# EAGLE design dimmer (EAGLE 6.2)
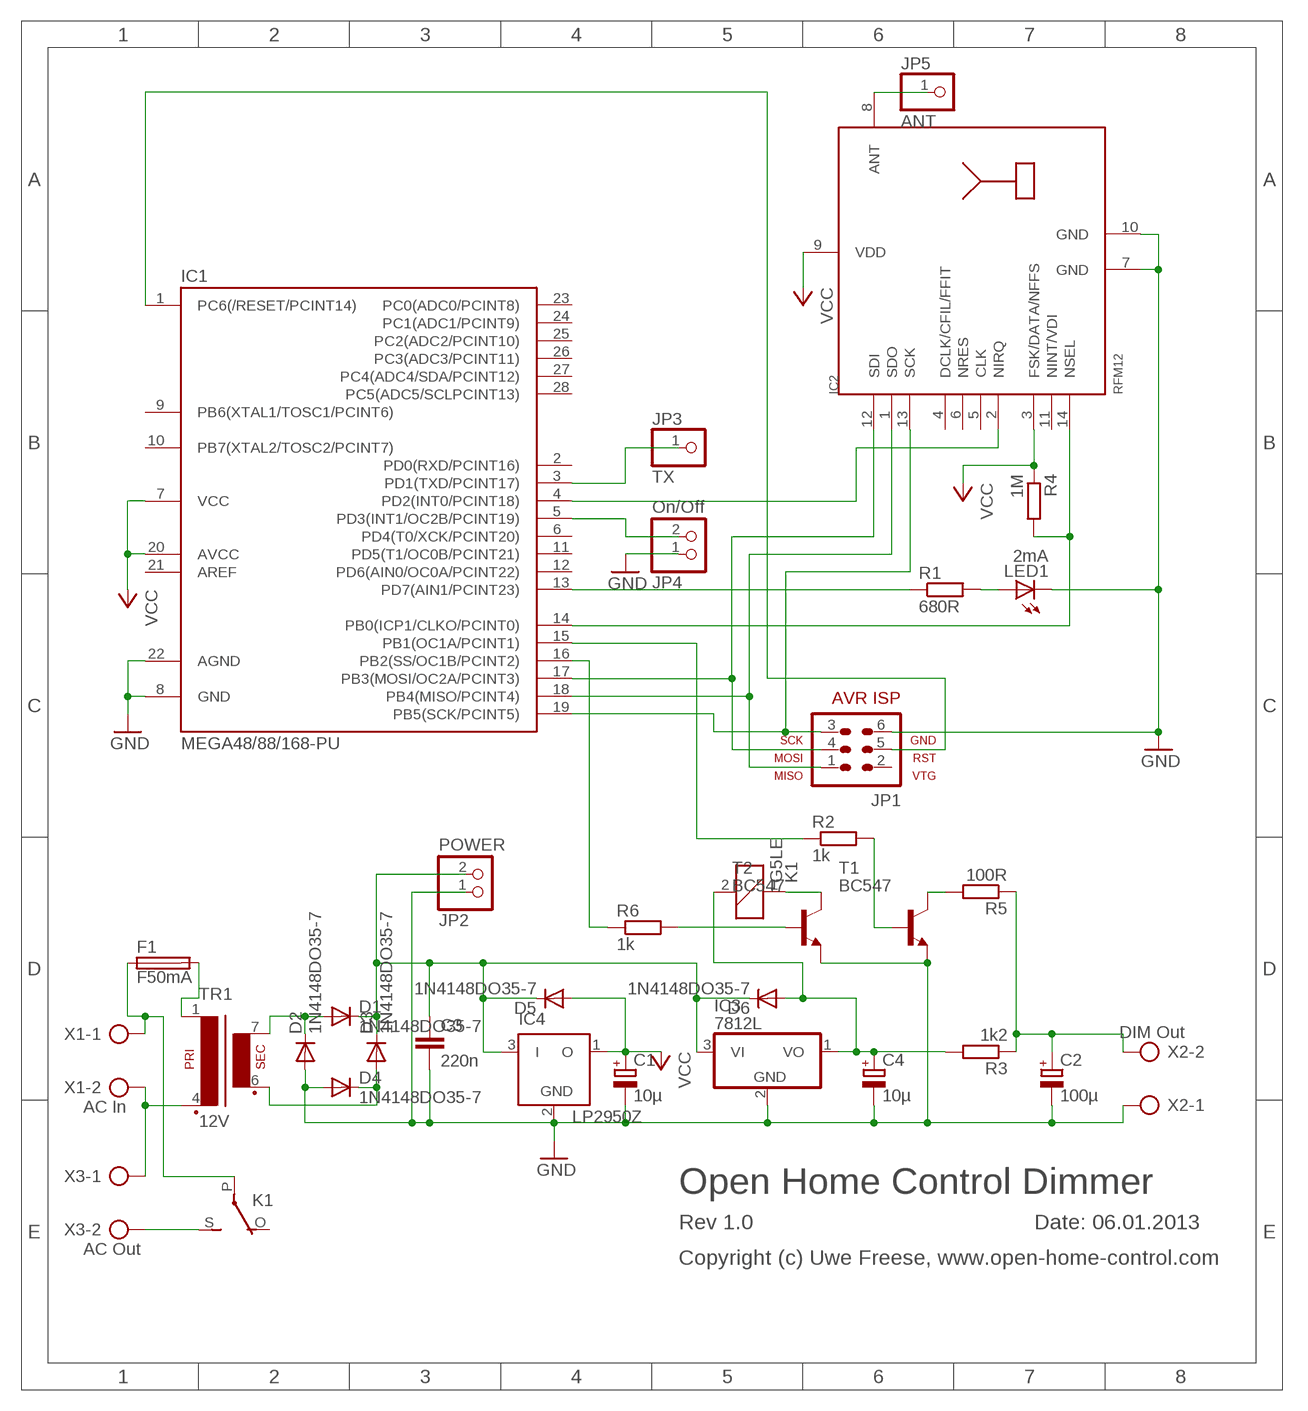
[diagram p0: schematic, sheet 1]

## Parts
C1  10µ  CPOL-EUE1.8-4  [E1,8-4]
C2  100µ  CPOL-EUE1.8-4  [E1,8-4]
C3  220n  C-EU025-030X050  [C025-030X050]
C4  10µ  CPOL-EUE1.8-4  [E1,8-4]
D1  1N4148DO35-7  [DO35-7]
D2  1N4148DO35-7  [DO35-7]
D3  1N4148DO35-7  [DO35-7]
D4  1N4148DO35-7  [DO35-7]
D5  1N4148DO35-7  [DO35-7]
D6  1N4148DO35-7  [DO35-7]
F1  F50mA  GSH15  [GSH15]
IC1  MEGA48/88/168-PU  [DIL28-3]
IC2  RFM12  [RFM]
IC3  7812L  [TO92]
IC4  LP2950Z  [TO92]
JP1  AVR-ISP-6  [AVR-ISP-6]
JP2  POWER  PINHD-1X2  [1X02]
JP3  TX  PINHD-1X1  [1X01]
JP4  On/Off  PINHD-1X2  [1X02]
JP5  ANT  PINHD-1X1  [1X01]
K1  G5LE  [G5LE]
LED1  2mA  LED3MM  [LED3MM]
R1  680R  R-EU_0207/7  [0207/7]
R2  1k  R-EU_0207/7  [0207/7]
R3  1k2  R-EU_0207/7  [0207/7]
R4  1M  R-EU_0207/7  [0207/7]
R5  100R  R-EU_0207/7  [0207/7]
R6  1k  R-EU_0207/7  [0207/7]
T1  BC547  [TO92]
T2  BC547  [TO92]
TR1  12V  EE20-1  [EE20-1]
X1  AC In  AK500/2  [AK500/2]
X2  DIM Out  AK500/2  [AK500/2]
X3  AC Out  AK500/2  [AK500/2]

## Nets
GND: C1.- C2.- C3.2 C4.- D2.A D4.A IC1.8(GND) IC1.22(AGND) IC2.7(GND) IC2.10(GND) IC3.2(GND) IC4.2(GND) JP1.6 JP2.1 JP4.1 LED1.K(C) T1.1(E) T2.1(E) X2.1
N$1: D1.A D2.C TR1.7(S4)
N$2: R5.2 T1.3(C)
N$3: IC1.17(PB3(MOSI/OC2A/PCINT3)) IC2.12(SDI) JP1.4
N$4: IC1.18(PB4(MISO/PCINT4)) IC2.1(SDO) JP1.1
N$5: IC1.19(PB5(SCK/PCINT5)) IC2.13(SCK) JP1.3
N$6: IC1.13(PD7(AIN1/PCINT23)) R1.1
N$7: D3.A D4.C TR1.6(S3)
N$8: IC1.1(PC6(/RESET/PCINT14)) JP1.5
N$9: C3.1 D1.C D3.C D5.C D6.C IC3.3(VI) IC4.3(I) JP2.2
N$10: C4.+ D6.A IC3.1(VO) K1.2 R3.2
N$11: IC2.8(ANT) JP5.1
N$12: LED1.A R1.2
N$13: IC1.14(PB0(ICP1/CLKO/PCINT0)) IC2.14(NSEL) R4.2
N$14: IC1.15(PB1(OC1A/PCINT1)) R2.1
N$15: IC1.4(PD2(INT0/PCINT18)) IC2.2(NIRQ)
N$16: R2.2 T1.2(B)
N$17: C2.+ R3.1 R5.1 X2.2
N$18: K1.1 T2.3(C)
N$19: TR1.4(P2) X1.2 X3.1
N$21: K1.S(2:S) X3.2
N$22: F1.1 K1.P(2:P) X1.1
N$23: F1.2 TR1.1
N$24: R6.2 T2.2(B)
N$25: IC1.16(PB2(SS/OC1B/PCINT2)) R6.1
N$26: IC1.3(PD1(TXD/PCINT17)) JP3.1
N$27: IC1.5(PD3(INT1/OC2B/PCINT19)) JP4.2
VCC: C1.+ D5.A IC1.7(VCC) IC1.20(AVCC) IC2.3(FSK/DATA/NFFS) IC2.9(VDD) IC4.1(O) R4.1
Unconnected: IC1.2(PD0(RXD/PCINT16)) IC1.6(PD4(T0/XCK/PCINT20)) IC1.9(PB6(XTAL1/TOSC1/PCINT6)) IC1.10(PB7(XTAL2/TOSC2/PCINT7)) IC1.11(PD5(T1/OC0B/PCINT21)) IC1.12(PD6(AIN0/OC0A/PCINT22)) IC1.21(AREF) IC1.23(PC0(ADC0/PCINT8)) IC1.24(PC1(ADC1/PCINT9)) IC1.25(PC2(ADC2/PCINT10)) IC1.26(PC3(ADC3/PCINT11)) IC1.27(PC4(ADC4/SDA/PCINT12)) IC1.28(PC5(ADC5/SCLPCINT13)) IC2.4(DCLK/CFIL/FFIT) IC2.5(CLK) IC2.6(NRES) IC2.11(NINT/VDI) JP1.2 K1.O(2:O)

## Notes on the sheet
- Open Home Control Dimmer
- Rev 1.0 | Date: 06.01.2013
- Copyright (c) Uwe Freese, www.open-home-control.com

## Library data of the parts
C1 C2 C4 = rcl:CPOL-EU: POLARIZED CAPACITOR, European symbol
C3 = rcl:C-EU: CAPACITOR, European symbol
D1-D6 = diode:1N4148: DIODE high speed (Philips)
F1 = fuse:GSH15: FUSE HOLDER grid 15mm, 19649 Wickmann; MPN: 64900001039; OC_FARNELL: 1271673; OC_NEWARK: 02P0318
IC1 = avr-5-4.16:MEGA48/88/168-PU
IC2 = hopeRF:RFM12
IC3 = linear:78*: Positive VOLTAGE REGULATOR Source: http://cache.national.com/ds/LM/LM78L05.pdf http://www.fairchildsemi.com/ds/LM/LM7805.pdf
IC4 = linear:LP2950: 100 mA, Low Power Low Dropout Voltage Regulator Source: http://www.onsemi.com/pub/Collateral/LP2950-D.PDF
JP1 = avr-5-4.16:AVR-ISP-6: AVR ISP-6 Serial Programming Header
JP2 JP4 = pinhead:PINHD-1X2: PIN HEADER
JP3 JP5 = pinhead:PINHD-1X1: PIN HEADER
K1 = relay:G5LE: RELAY 1 x switch, 10 A/120 V AC, 8 A/30 V DC, Omron; OC_FARNELL: unknown; OC_NEWARK: unknown
LED1 = led:LED: LED OSRAM: - CHIPLED LG R971, LG N971, LY N971, LG Q971, LY Q971, LO R971, LY R971 LH N974, LH R974 LS Q976, LO Q976, LY Q976 LO Q996 - Hyper CHIPLED LW Q18S LB Q993, LB Q99A, LB R99A - SideLED LS A670, LO A670, LY A670, LG A670, LP A670 LB A673, LV A673, LT A673, LW A673 LH A674 LY A675 LS A676, LA A676, LO A676, LY A676, LW A676 LS A679, LY A679, LG A679 - Hyper Micro SIDELED® LS Y876, LA Y876, LO Y876, LY Y876 LT Y87S - SmartLED LW L88C, LW L88S LB L89C, LB L89S, LG L890 LS L89K, LO L89K, LY L89K LS L896, LA L896, LO L896, LY L896 - TOPLED LS T670, LO T670, LY T670, LG T670, LP T670 LSG T670, LSP T670, LSY T670, LOP T670, LYG T670 LG T671, LOG T671, LSG T671 LB T673, LV T673, LT T673, LW T673 LH T674 LS T676, LA T676, LO T676, LY T676, LB T676, LH T676, LSB T676, LW T676 LB T67C, LV T67C, LT T67C, LS T67K, LO T67K, LY T67K, LW E67C LS E67B, LA E67B, LO E67B, LY E67B, LB E67C, LV E67C, LT E67C LW T67C LS T679, LY T679, LG T679 LS T770, LO T770, LY T770, LG T770, LP T770 LB T773, LV T773, LT T773, LW T773 LH T774 LS E675, LA E675, LY E675, LS T675 LS T776, LA T776, LO T776, LY T776, LB T776 LHGB T686 LT T68C, LB T68C - Hyper Mini TOPLED® LB M676 - Mini TOPLED Santana® LG M470 LS M47K, LO M47K, LY M47K Source: http://www.osram.convergy.de LUXEON: - LUMILED® LXK2-PW12-R00, LXK2-PW12-S00, LXK2-PW14-U00, LXK2-PW14-V00 LXK2-PM12-R00, LXK2-PM12-S00, LXK2-PM14-U00 LXK2-PE12-Q00, LXK2-PE12-R00, LXK2-PE12-S00, LXK2-PE14-T00, LXK2-PE14-U00 LXK2-PB12-K00, LXK2-PB12-L00, LXK2-PB12-M00, LXK2-PB14-N00, LXK2-PB14-P00, LXK2-PB14-Q00 LXK2-PR12-L00, LXK2-PR12-M00, LXK2-PR14-Q00, LXK2-PR14-R00 LXK2-PD12-Q00, LXK2-PD12-R00, LXK2-PD12-S00 LXK2-PH12-R00, LXK2-PH12-S00 LXK2-PL12-P00, LXK2-PL12-Q00, LXK2-PL12-R00 Source: www.luxeon.com KINGBRIGHT: KA-3528ASYC Source: www.kingbright.com
R1-R6 = rcl:R-EU_: RESISTOR, European symbol
T1 T2 = transistor:BC547: NPN TRANSISTOR
TR1 = trafo:EE20-1: TRANSFORMER 1 primary winding, 1 secondary winding ERA
X1-X3 = con-ptr500:AK500/2: CONNECTOR; OC_FARNELL: unknown; OC_NEWARK: unknown

## Board
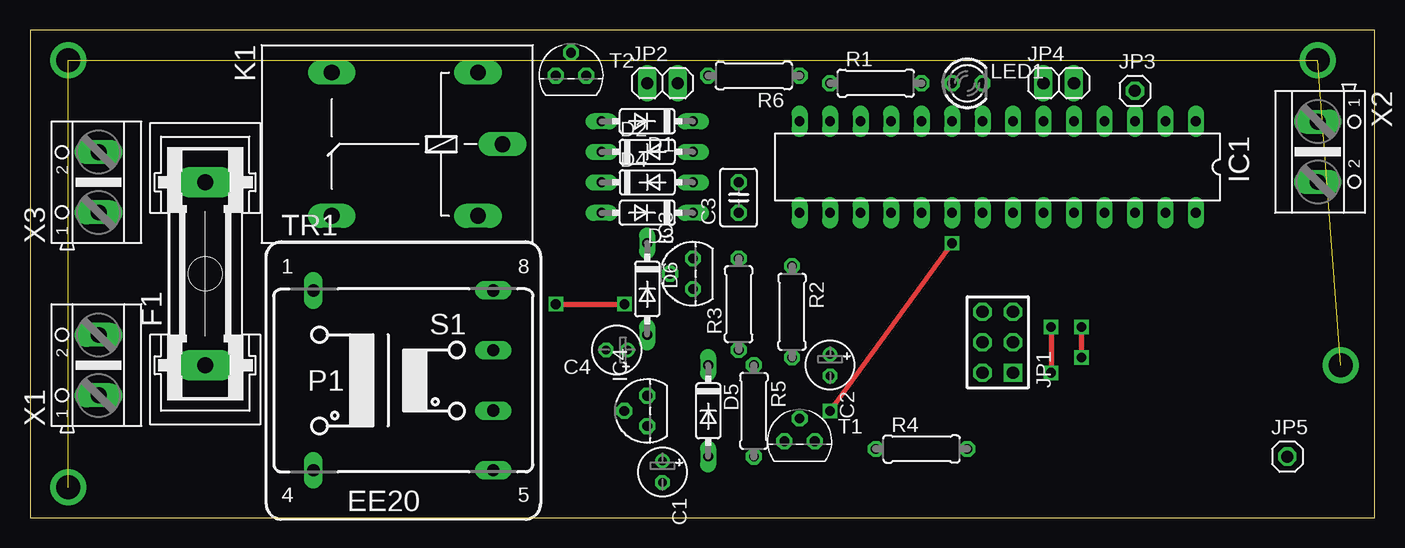
[diagram p1: board, top side]
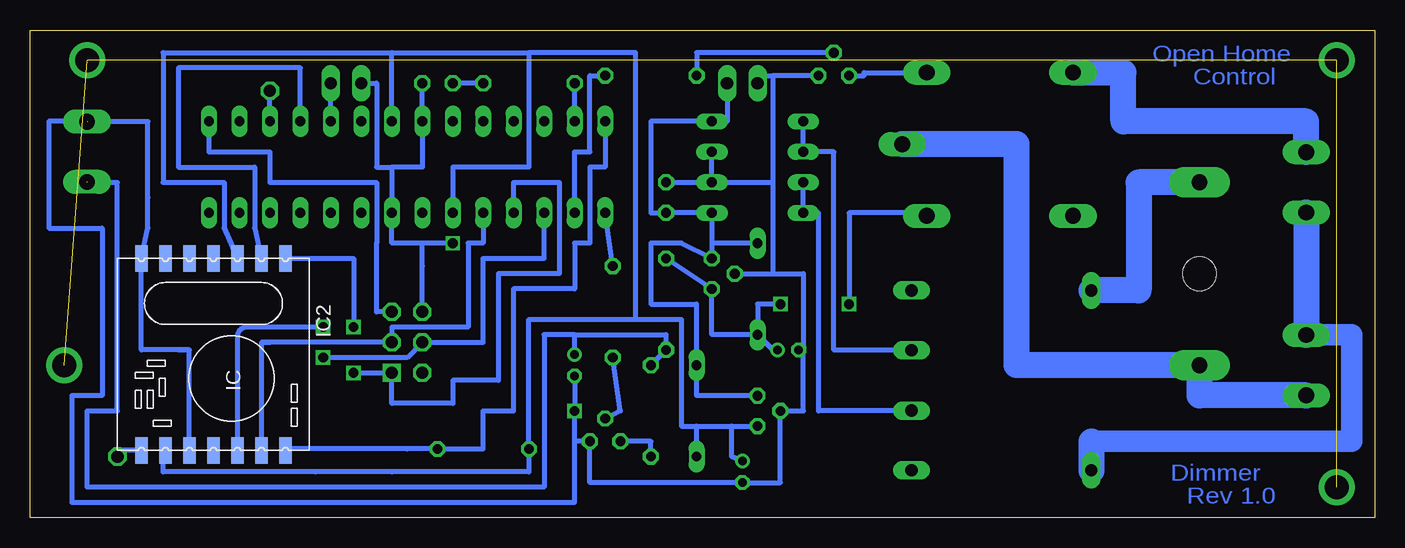
[diagram p2: board, bottom side, seen from below]

Size 112.06 x 40.63 mm. Coordinates in mm from the lower left corner, seen from the top.
Outline: 0,0 112.06,0 112.06,40.63 0,40.63 0,0
Copper layers (1*16): Top 0.035mm / dielectric 1.5mm / Bottom 0.035mm
Design rules: minimum track width 10mil, minimum drill 24mil, track to track 8mil, track to pad 8mil, pad to pad 8mil, via to via 8mil, smd to smd 8mil, copper to edge 40mil, drill to drill 8mil, minimum pad ring 10mil, minimum via ring 8mil, stop-mask expansion 4mil, vias tented up to drill 0mil, thermal gap 10mil

### Footprints (pad centres in the part's own frame; a part is rotated, then mirrored left to right if it is on the bottom)
E1,8-4 = drill 0.711 pad 1.168: + -0.889,0 | drill 0.711 pad 1.168 octagon: - 0.889,0
C025-030X050 = drill 0.813 octagon: 1 -1.27,0; 2 1.27,0
DO35-7 = drill 0.813 long: A 3.81,0; C -3.81,0
GSH15 = drill 1.321 pad 2.54 long: 1 -7.62,0; 2 7.62,0 | hole 2.794: 0,0
DIL28-3 = drill 0.813 long: 1 -16.51,-3.81; 2 -13.97,-3.81; 3 -11.43,-3.81; 4 -8.89,-3.81; 5 -6.35,-3.81; 6 -3.81,-3.81; 7 -1.27,-3.81; 8 1.27,-3.81; 9 3.81,-3.81; 10 6.35,-3.81; 11 8.89,-3.81; 12 11.43,-3.81; 13 13.97,-3.81; 14 16.51,-3.81; 15 16.51,3.81; 16 13.97,3.81; 17 11.43,3.81; 18 8.89,3.81; 19 6.35,3.81; 20 3.81,3.81; 21 1.27,3.81; 22 -1.27,3.81; 23 -3.81,3.81; 24 -6.35,3.81; 25 -8.89,3.81; 26 -11.43,3.81; 27 -13.97,3.81; 28 -16.51,3.81
RFM = smd 2.184 x 1.067: 1 0,14; 2 0,12; 3 0,10; 4 0,8; 5 0,6; 6 0,4; 7 0,2; 8 16,2; 9 16,4; 10 16,6; 11 16,8; 12 16,10; 13 16,12; 14 16,14
TO92 = drill 0.813 octagon: 1 -1.27,0; 2 0,1.905; 3 1.27,0
AVR-ISP-6 = drill 1.016 square: 1 -2.54,-1.27 | drill 1.016 octagon: 2 -2.54,1.27; 3 0,-1.27; 4 0,1.27; 5 2.54,-1.27; 6 2.54,1.27
1X02 = drill 1.016 long: 1 -1.27,0; 2 1.27,0
1X01 = drill 1.016 octagon: 1 0,0
G5LE = drill 1.321 long: 1 -7.493,-5.969; 2 -7.493,5.969; O 4.699,5.969; P -9.525,0; S 4.699,-5.969
LED3MM = drill 0.813 octagon: A -1.27,0; K 1.27,0
0207/7 = drill 0.813 octagon: 1 -3.81,0; 2 3.81,0
TO92' = drill 0.813 octagon: 1 1.27,0; 2 0,1.905; 3 -1.27,0
EE20-1 = drill 1.016 long: 1 -7.493,7.493; 4 -7.493,-7.493; 5 7.493,-7.493; 6 7.493,-2.515; 7 7.493,2.515; 8 7.493,7.493
AK500/2 = drill 1.321 long: 1 -2.515,0; 2 2.515,0

### Placement (x,y rotation side)
C1  52.7,3.81 270 top
C2  66.67,12.7 270 top
C3  59.06,26.67 90 top
C4  48.89,13.97 180 top
D1  51.44,33.02 180 top
D2  51.44,30.48 0 top
D3  51.44,25.4 180 top
D4  51.44,27.94 0 top
D5  56.52,8.89 270 top
D6  51.44,19.05 270 top
F1  14.61,20.32 90 top
IC1  80.65,29.21 180 top
IC2  104.78,21.59 270 bottom
IC3  55.25,20.32 90 top
IC4  51.44,8.89 90 top
JP1  80.65,14.61 90 top
JP2  52.7,36.2 0 top
JP3  92.08,35.56 0 top
JP4  85.73,36.2 0 top
JP5  104.78,5.08 0 top
K1  29.84,31.11 180 top
LED1  78.11,36.2 0 top
R1  70.48,36.2 0 top
R2  63.5,17.14 270 top
R3  59.06,17.78 90 top
R4  74.3,5.71 0 top
R5  60.33,8.89 270 top
R6  60.33,36.83 180 top
T1  BC547  [TO92']  64.14,6.35 0 top
T2  BC547  [TO92']  45.08,36.83 0 top
TR1  31.11,11.43 0 top
X1  5.71,12.7 90 top
X2  107.31,30.48 270 top
X3  5.71,27.94 90 top

### Tracks (layer width: path | path; a pad name or v marks a point on that pad's centre or on a via)
GND  (via drill 0.8)  (1 unrouted)
  Top 0.406: v66.67,8.89 v76.84,22.86
  Bottom 0.406: D4.A D2.A | 79.38,20.95 JP1.6 79.38,20.95 | 79.38,20.95 79.38,22.86 | 79.38,22.86 80.65,22.86 81.92,22.86 IC1.22 81.92,29.21 | 81.92,29.21 79.38,29.21 IC1.8 LED1.K | IC2.10 98.78,13.97 | 98.78,13.97 99.7,13.97 98.78,13.97 | 98.78,13.97 102.78,13.97 IC2.7 102.23,24.13 102.23,26.67 102.23,32.99 X2.1 | 79.38,20.95 79.38,22.86 | C2.- v66.67,8.89 66.67,6.35 | 47.62,13.97 47.62,8.89 IC4.2 49.53,2.92 C1.- 65.41,2.92 T1.1 66.67,6.35 | 47.62,13.97 C4.- | IC3.2 50.17,20.32 | 50.17,20.32 47.62,20.32 47.62,13.97 | D4.A 50.17,27.94 | 50.17,27.94 50.17,20.32 | T2.1 50.17,36.83 | 50.17,36.83 50.17,27.94 | C3.2 D4.A | 107.31,33.02 110.49,33.02 110.49,24.13 106.05,24.13 106.05,10.16 108.59,10.16 108.59,1.27 66.67,1.27 66.67,6.35 | JP2.1 51.44,36.83 50.17,36.83 | JP4.1 83.19,36.2 83.19,29.21 81.92,29.21 | v76.84,22.86 79.38,22.86
N$1
  Bottom 0.406: TR1.7 45.08,13.95 45.08,30.48 D2.C D1.A
N$2
  Bottom 0.406: R5.2 60.33,6.35 T1.3
N$3  (via drill 0.8)
  Top 0.406: v87.63,13.34 v87.63,15.88
  Bottom 0.406: IC1.17 69.22,21.59 74.3,21.59 74.3,14.61 JP1.4 80.65,13.34 v87.63,13.34 | v87.63,15.88 93.98,15.88 arc-90 94.78,15.08 IC2.12
N$4  (via drill 0.8)
  Top 0.406: v85.09,15.88 v85.09,12.06
  Bottom 0.406: IC1.18 71.76,27.94 67.94,27.94 67.94,20.32 73.03,20.32 73.03,11.43 76.84,11.43 76.84,9.53 81.92,9.53 JP1.1 v85.09,12.06 | IC2.1 85.09,21.59 v85.09,15.88
N$5
  Bottom 0.406: IC1.19 74.3,22.86 75.56,22.86 75.56,15.88 81.92,15.88 JP1.3 92.08,14.61 | 92.08,14.61 92.78,14.61 | 92.78,14.61 92.08,14.61 | 92.08,14.61 92.78,14.61 | 92.78,14.61 92.08,14.61 | 92.08,14.61 92.78,14.61 | 92.78,14.61 IC2.13
N$6
  Bottom 0.406: IC1.13 R1.1
N$7
  Bottom 0.406: TR1.6 38.73,8.91 46.36,8.89 46.36,25.4 D3.A D4.C
N$8
  Bottom 0.406: IC1.1 97.16,30.48 92.08,30.48 92.08,27.94 83.19,27.94 83.19,22.86 83.19,17.14 JP1.5
N$9
  Bottom 0.406: D6.C 55.25,22.86 | 55.25,22.86 IC3.3 57.78,22.86 59.06,22.86 60.33,22.86 60.33,17.78 56.52,17.78 D5.C 56.52,10.16 IC4.3 | 55.25,22.86 D3.C C3.1 60.33,25.4 60.33,33.02 D1.C 53.97,33.02 JP2.2
N$10  (via drill 0.8)
  Top 0.406: v43.81,17.78 v49.53,17.78
  Bottom 0.406: R3.2 IC3.1 55.25,15.24 D6.A | C4.+ 50.17,13.97 D6.A | K1.2 37.34,25.4 43.81,25.4 v43.81,17.78 | v49.53,17.78 51.44,17.78 D6.A
N$11
  Bottom 0.406: IC2.8 104.78,5.59 JP5.1
N$12
  Bottom 0.406: R1.2 LED1.A
N$13
  Bottom 0.406: IC1.14 64.14,29.21 65.41,29.21 65.41,22.86 66.67,22.86 66.67,19.05 71.76,19.05 71.76,8.89 74.3,8.89 74.3,5.71 R4.2 80.65,5.71 90.81,5.71 90.81,5.62 IC2.14
N$14
  Bottom 0.406: R2.1 IC1.15
N$15
  Bottom 0.406: IC1.4 89.53,37.47 99.7,37.47 99.7,29.21 93.34,29.21 93.34,24.13 IC2.2
N$16
  Bottom 0.406: T1.2 62.86,8.89 R2.2
N$17  (1 unrouted)
  Bottom 0.406: R5.1 R3.1 59.06,15.24 66.67,15.24 | C2.+ 66.67,15.24 | 66.67,15.24 69.22,15.24 69.22,2.54 107.31,2.54 107.31,8.89 104.78,8.89 104.78,27.94 106.05,27.94 107.31,27.94
N$18
  Bottom 0.406: T2.3 42.55,36.83 42.55,37.08 K1.1
N$19
  Bottom 1.778: X1.2 1.9,15.21 1.9,6.35 23.62,6.35
  Bottom 2.184: X3.1 X1.2 | 23.62,6.35 TR1.4
N$20  (via drill 2)  (3 unrouted)
  other vias: 3.17,38.1 3.17,2.54 107.31,38.1 109.22,12.7
N$21
  Bottom 2.184: X3.2 5.71,33.02 20.95,33.02 20.95,37.08 K1.S
N$22
  Bottom 2.184: X1.1 14.61,10.19 F1.1 29.84,12.7 29.84,31.11 K1.P
N$23
  Bottom 2.184: F1.2 19.69,27.94 19.69,18.92 TR1.1
N$24
  Bottom 0.406: T2.2 56.52,38.73 R6.2
N$25
  Bottom 0.406: IC1.16 66.67,30.48 65.41,30.48 65.41,36.83 R6.1
N$26
  Bottom 0.406: IC1.3 JP3.1
N$27
  Bottom 0.406: IC1.5 JP4.2
VCC
  Bottom 0.406: C1.+ 53.59,5.08 53.59,7.62 | 53.59,7.62 IC4.1 | IC1.7 81.92,38.73 | 81.92,38.73 70.48,38.73 | 70.48,38.73 70.48,36.83 | 70.48,36.83 70.48,29.21 76.84,29.21 IC1.20 | IC2.9 100.97,5.4 100.97,3.81 88.27,3.81 81.92,3.81 70.48,3.81 R4.1 70.48,16.51 61.59,16.51 | 61.59,16.51 57.78,16.51 57.78,7.62 56.52,7.62 | 56.52,7.62 53.59,7.62 | D5.A 56.52,7.62 | 61.59,16.51 61.59,38.73 70.48,38.73 | 70.48,38.73 70.48,36.83 | 81.92,38.73 100.97,38.73 100.97,27.94 95.89,27.94 95.89,24.13 IC2.3

### Text on the board
Bottom: Open Home | Control | Dimmer | Rev 1.0